# Altium schematic sheet 03_ICs.SchDoc: ICs (part 3 of 3)
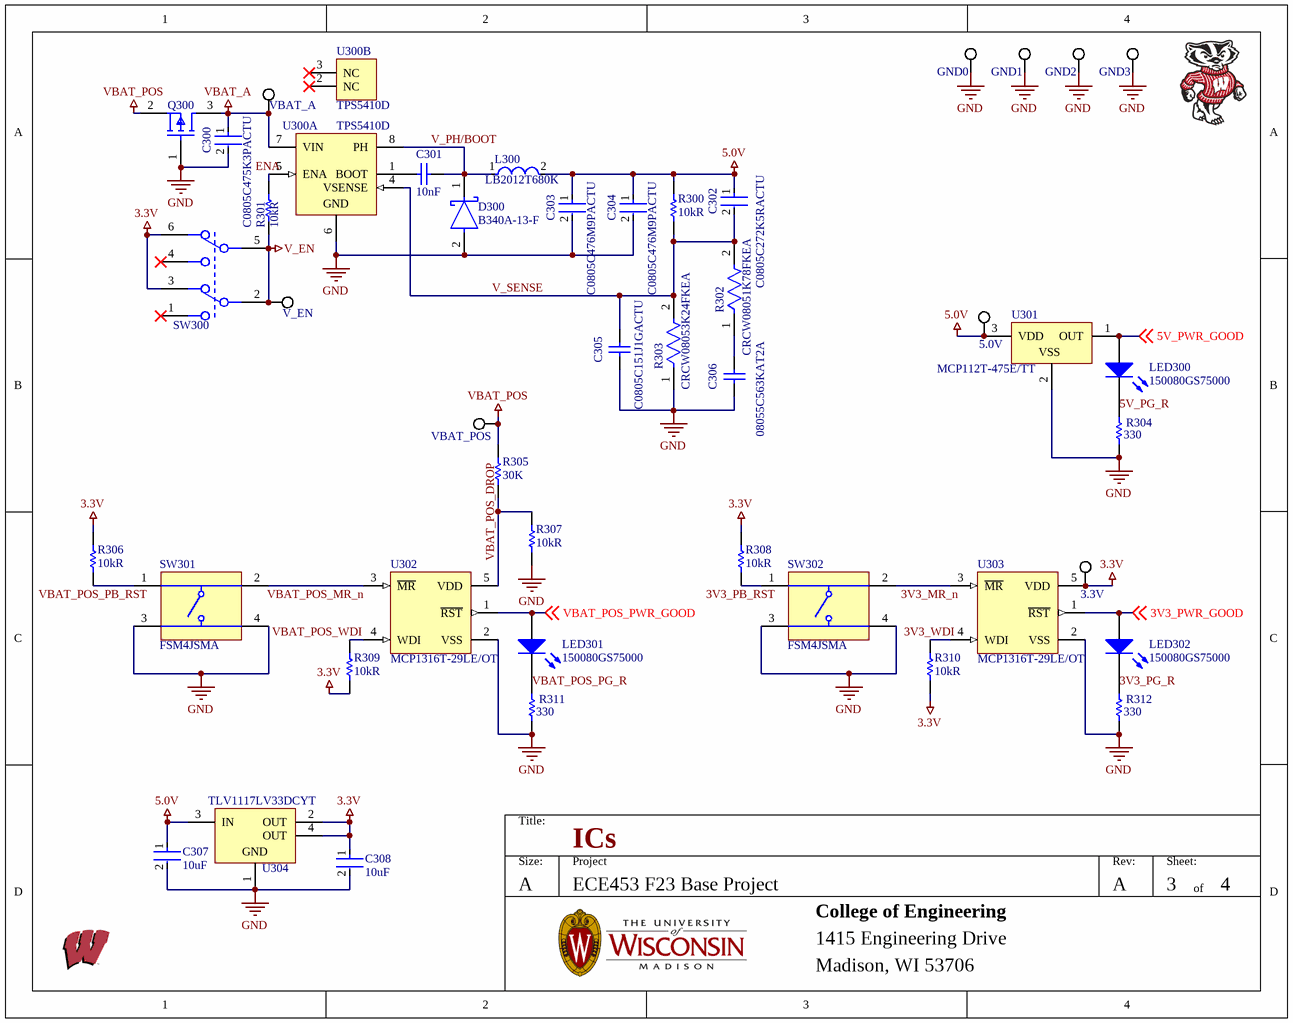
[diagram p2: 03_ICs.SchDoc]

## Library data of the parts (continued)
U300 = CMP-0323-00191-3: Buck Step Down Regulator with 5.5 to 36 V Input and 1.23 to 31 V Output, -40 to 125 degC, 8-Pin SOIC (D), Green (RoHS & no Sb/Br); Manufacturer: Texas Instruments; Switch Current Limit(Typ)(A): 1.2; Iq(Typ)(mA): 3; Rating: Catalog; Duty Cycle(Max)(%): 87.5; Iout(Max)(A): 1; Vin(Max)(V): 36; Vout(Min)(V): 1.23; Vout(Max)(V): 31; SubFamily: Step-Down Regulator; Vin(Min)(V): 5.5; Package Body Material: Plastic; Throw Configuration: SWITCHING REGULATOR; Control Technique: PULSE WIDTH MODULATION; Max Supply Voltage: 36V; Min Input Voltage: 5.5V; Max Output current: 1.8A; Frequency: 600kHz; Control Mode: VOLTAGE-MODE; Package Equivalence Code: SOP8,.25; Qualification Status: Not Qualified; ComponentLink2URL: http://www.ti.com/litv/pdf/msoi002j; PartNumber: TPS5410D; DatasheetVersion: SLVS675A; PackageDescription: 8-Pin Plastic Small Outline Integrated Circuit, 4.9 x 3.9 mm, Pitch 1.27 mm Pitch; Topology: Buck; PackageVersion: revM, Jun-2011; Code_JEDEC: MS-012AA; ComponentLink3Description: URL Link1; ComponentLink1Description: Datasheet; ComponentLink1URL: http://www.ti.com/general/docs/lit/getliterature.tsp?genericPartNumber=TPS5410&fileType=pdf; Eco-Plan: Green (RoHS & no Sb/Br); ComponentLink3URL: Samples URL:http://www.ti.com/product/tps5410#samples; Mounting Technology: Surface Mount; ComponentLink2Description: Package Specification; PackageReference: D0008A; Regulated Outputs(#): 1; Supplier: Digi-Key; Supplier Part Number: 296-20787-5-ND; Manufacturer Part Number: TPS5410D; RoHS: Yes; Category: Voltage Regulators - Switching; Stock: 6339; Pricing: 1=3.42, 10=3.072, 25=2.9044, 100=2.517, 250=2.38796, 500=2.1427, 1000=1.80709, 2500=1.71674, 5000=1.6522 (USD); Case/Package: SOP; Pins: 8; Package Shape: Rectangular; Terminal Finish: Nickel; Min Operating Temperature: -40°C; Max Operating Temperature: 125°C; JESD-609 Code: e4; Moisture Sensitivity Level: 2; Channels: 1; Package Style: SMALL OUTLINEMeter; Surface Mount: Yes; Switcher Configuration: BUCK; Terminal Form: Gull Wing; Terminal Position: DUAL; Peak Reflow Temperature (Cel): 260°C; JESD-30 Code: R-PDSO-G8; Length: 4.9mm; Width: 3.9mm; Height - Seated (Max): 1.75mm; Terminal Pitch: 1.27mm; Temperature Grade: AUTOMOTIVE; Reach SVHC Compliant: Yes; RoHS Compliant: Yes; ComponentLink4URL: https://www.ti.com:443/lit/ds/symlink/tps5410.pdf?src-supplier=IHS+Markit; ComponentLink4Description: https://www.ti.com:443/lit/ds/symlink/tps5410.pdf?src-supplier=IHS+Markit; ComponentLink5URL: https://datasheet.ciiva.com/15113/getdatasheetpartid-224296-15113874.pdf?src-supplier=Verical; ComponentLink5Description: https://datasheet.ciiva.com/15113/getdatasheetpartid-224296-15113874.pdf?src-supplier=Verical; ComponentLink6URL: https://datasheet.ciiva.com/2026/tps5410-2026736.pdf?src-supplier=Digi-Key; ComponentLink6Description: https://datasheet.ciiva.com/2026/tps5410-2026736.pdf?src-supplier=Digi-Key; ComponentLink7URL: https://datasheet.ciiva.com/27056/2003563-27056017.pdf?src-supplier=Jameco; ComponentLink7Description: https://datasheet.ciiva.com/27056/2003563-27056017.pdf?src-supplier=Jameco; ComponentLink8URL: https://datasheet.ciiva.com/7993/1851017-7993797.pdf?src-supplier=Element14; ComponentLink8Description: https://datasheet.ciiva.com/7993/1851017-7993797.pdf?src-supplier=Element14
U301 = CMP-0130-00073-1: 1.75Î¼A Micropower Voltage Detector, Push-Pull Output, 4.63V, 3-Pin SOT-23, Extended Temperature, Tape and Reel; Manufacturer: Microchip; Package Body Material: Plastic; Adjustable Threshold: No; Throw Configuration: POWER SUPPLY SUPPORT CIRCUIT; Number of Channels: 1; Package Equivalence Code: TO-236; Power Supplies: 1/5.5V; Supply Current-Max (Isup): 1.75uA; Max Supply Voltage: 5.5V; Min Supply Voltage: 1V; Time @ Peak Reflow Temperature-Max (s): 40s; Qualification Status: Not Qualified; PackageReference: SOT-23-TT3; DatasheetVersion: revD, Jun-2005; Code_IPC: SOT23-3; PackageDescription: 3-Lead Plastic Small Outline Transistor (TT) [SOT-23]; PackageVersion: revBB, Aug-2009; Supplier: Digi-Key; Supplier Part Number: MCP112T-475E/TTCT-ND; Manufacturer Part Number: MCP112T-475E/TT; RoHS: Yes; Category: Voltage Supervisors; Stock: 2856; Pricing: 1=0.6, 25=0.5, 100=0.46 (USD); Case/Package: TSSOP; Pins: 3; Package Shape: Rectangular; Terminal Finish: Tin; Min Operating Temperature: -40°C; Max Operating Temperature: 125°C; JESD-609 Code: e3; JESD-30 Code: R-PDSO-G3; Moisture Sensitivity Level: 1; Channels: 1; Package Style: SMALL OUTLINE, THIN PROFILE, SHRINK PITCHMeter; Peak Reflow Temperature (Cel): 260°C; Surface Mount: Yes; Terminal Form: Gull Wing; Terminal Position: DUAL; Threshold Voltage-Nom: 4.63V; Length: 2.92mm; Width: 1.3mm; Height - Seated (Max): 1.12mm; Terminal Pitch: 0.96mm; Temperature Grade: AUTOMOTIVE; Reach SVHC Compliant: Yes; RoHS Compliant: Yes; ComponentLink1URL: https://datasheet.ciiva.com:443/pdfs/VipMasterIC/IC/MCHP/MCHP-S-A0002312823/MCHP-S-A0002312823-1.pdf?src-supplier=IHS+Markit; ComponentLink1Description: https://datasheet.ciiva.com:443/pdfs/VipMasterIC/IC/MCHP/MCHP-S-A0002312823/MCHP-S-A0002312823-1.pdf?src-supplier=IHS+Markit; ComponentLink2URL: https://datasheet.ciiva.com/1974/21889d-1974510.pdf?src-supplier=Digi-Key; ComponentLink2Description: https://datasheet.ciiva.com/1974/21889d-1974510.pdf?src-supplier=Digi-Key; ComponentLink3URL: https://datasheet.ciiva.com/1974/21889d-1974511.pdf?src-supplier=Digi-Key; ComponentLink3Description: https://datasheet.ciiva.com/1974/21889d-1974511.pdf?src-supplier=Digi-Key; ComponentLink4URL: https://datasheet.ciiva.com/1974/21889d-1974512.pdf?src-supplier=Digi-Key; ComponentLink4Description: https://datasheet.ciiva.com/1974/21889d-1974512.pdf?src-supplier=Digi-Key; ComponentLink5URL: https://datasheet.ciiva.com/9215/21889d-9215465.pdf?src-supplier=Avnet; ComponentLink5Description: https://datasheet.ciiva.com/9215/21889d-9215465.pdf?src-supplier=Avnet; ComponentLink6URL: https://datasheet.ciiva.com/1170/21889d-1170331.pdf?src-supplier=Element14; ComponentLink6Description: https://datasheet.ciiva.com/1170/21889d-1170331.pdf?src-supplier=Element14
U302 U303 = CMP-0138-00207-1: Voltage Supervisor, 5-Pin SOT-23, Extended Temperature, Tape and Reel; Manufacturer: Microchip; Min Supply Voltage: 1V; Max Supply Voltage: 5.5V; Number of Voltages Monitored: 1; Overvoltage Threshold: 2.944V; Undervoltage Threshold: 2.857V; Operating Supply Current: 10uA; Reset: Active Low; Reset Timeout: 140ms; Threshold Voltage: 2.9V; Watchdog Timer: Yes; Quiescent Current: 1uA; Max Output current: 10mA; Max Power Dissipation: 240mW; Output: TOTEM-POLE; PackageReference: SOT-23-OT5; Code_IPC: SOT23-5; DatasheetVersion: revB, Oct-2007; PackageDescription: 5-Lead Plastic Small Outline Transistor (OT) [SOT-23]; PackageVersion: revBB, Aug-2009; Supplier: Newark; Supplier Part Number: 34M7402; Manufacturer Part Number: MCP1316T-29LE/OT; RoHS: Yes; Category: Voltage Supervisors; Stock: 8598; Pricing: 1=0.877, 10=0.805, 25=0.732 (USD); Mounting Technology: Surface Mount; Case/Package: SOT-23; Pins: 5; Min Operating Temperature: -40°C; Max Operating Temperature: 125°C; Packaging: Tape and Reel; Type: Simple Reset/Power-On Reset; Package Quantity: 3000; Max Supply Current: 10uA; Max Reset Threshold Voltage: 2.944V; Min Reset Threshold Voltage: 2.857V; Supply Current: 10uA; Number of Elements: 1; Power Dissipation: 240mW; Termination: SMD/SMT; Length: 3.1mm; Width: 1.8mm; Height: 1.3mm; Radiation Hardening: No; Reach SVHC Compliant: No; Lead Free: Lead Free; RoHS Compliant: Yes; ComponentLink1URL: https://datasheet.ciiva.com/1969/21985d-1969832.pdf?src-supplier=Digi-Key; ComponentLink1Description: https://datasheet.ciiva.com/1969/21985d-1969832.pdf?src-supplier=Digi-Key; ComponentLink2URL: https://datasheet.ciiva.com/1969/21985d-1969833.pdf?src-supplier=Digi-Key; ComponentLink2Description: https://datasheet.ciiva.com/1969/21985d-1969833.pdf?src-supplier=Digi-Key; ComponentLink3URL: https://datasheet.ciiva.com/14562/70045388-14562791.pdf?src-supplier=Allied+Electronics; ComponentLink3Description: https://datasheet.ciiva.com/14562/70045388-14562791.pdf?src-supplier=Allied+Electronics; ComponentLink4URL: https://datasheet.ciiva.com/8140/21985c-8140440.pdf?src-supplier=Avnet; ComponentLink4Description: https://datasheet.ciiva.com/8140/21985c-8140440.pdf?src-supplier=Avnet
U304 = CMP-0395-00499-2: Single Output LDO, 1 A, Fixed 3.3 V Output, 2 to 5.5 V Input, 4-pin SOT-223 (DCY), -40 to 125 degC, Green (RoHS & no Sb/Br); Manufacturer: Texas Instruments; Manufacturer Part Number: TLV1117-33CDCYR; Vout Adj(Max)(V): 3.3; Iout(Max)(A): 1; SubFamily: Single Channel LDO; Iq(Typ)(mA): 0.05; Accuracy(%): 2; Vin(Max)(V): 5.5; Vdo(Typ)(mV): 1200; Max Power Dissipation: 1.59W; Dropout Voltage: 455mV; Output Voltage: 3.3V; Output Current: 1A; Max Input Voltage: 5.5V; Min Input Voltage: 2V; Min Current Limit: 1.1A; Polarity: Positive; Quiescent Current: 50uA; Output Voltage Accuracy: 1.5%; Accuracy: 2%; Power Supply Rejection Ratio (PSRR): 75dB; Max Supply Voltage: 15V; PartNumber: TLV1117LV33DCYT; PackageReference: DCY0004A; PackageVersion: 4202506/B; ComponentLink1URL: http://www.ti.com/; DatasheetVersion: SBVS160A; Mounting Technology: Surface Mount; Fixed Output Options(V): 3.3; ComponentLink3Description: Package Specification; PackageDescription: 4-Pin Plastic Small Outline, Body 3.5 x 6.5 mm, Pitch 2.3 mm; Vout Adj(Min)(V): 3.3; ComponentLink2URL: http://www.ti.com/general/docs/lit/getliterature.tsp?genericPartNumber=TLV1117LV33&fileType=pdf; Code_JEDEC: TO-261; ComponentLink1Description: Manufacturer URL; Vin(Min)(V): 2; ComponentLink2Description: Datasheet; Eco-Plan: Green (RoHS & no Sb/Br); ComponentLink3URL: http://www.ti.com/litv/pdf/mpds094a; Supplier 1: Digi-Key; Supplier Part Number 1: 296-35976-1-ND; Manufacturer 1: Texas Instruments; Manufacturer Part Number 1: TLV1117LV33DCYT; RoHS: Yes; Category: Voltage Regulators - Linear; Stock 1: 1411; Pricing 1: 1=1.15000, 10=1.02600, 25=0.97360, 100=0.79970 (USD); Case/Package: SOT-223; Number of Pins: 4; Contact Plating: Tin; Min Operating Temperature: -40°C; Max Operating Temperature: 125°C; Package Quantity: 250; Packaging: Tape and Reel; Number of Outputs: 1; Nominal Output Voltage: 3.3V; Max Output Current: 1A; Number of Regulators: 1; Power Dissipation: 1.59W; Max Output Voltage: 3.3V; Min Output Voltage: 3.3V; Output Type: Fixed; Series: -; Output Configuration: Positive; Radiation Hardening: No; Reach SVHC Compliant: Yes; Lead Free: Lead Free; RoHS Compliant: Yes; ComponentLink4URL: http://www.ti.com/general/docs/lit/getliterature.tsp?genericPartNumber=TLV1117LV&&fileType=pdf&src-supplier=Farnell; ComponentLink4Description: http://www.ti.com/general/docs/lit/getliterature.tsp?genericPartNumber=TLV1117LV&&fileType=pdf&src-supplier=Farnell; ComponentLink5URL: http://www.farnell.com/datasheets/1950591.pdf?src-supplier=Element14; ComponentLink5Description: http://www.farnell.com/datasheets/1950591.pdf?src-supplier=Element14; ComponentLink6URL: http://www.ti.com/lit/ds/symlink/tlv1117lv.pdf?src-supplier=Digi-Key; ComponentLink6Description: http://www.ti.com/lit/ds/symlink/tlv1117lv.pdf?src-supplier=Digi-Key; ComponentLink7URL: http://www.ti.com/general/docs/suppproductinfo.tsp?distId=10&amp;gotoUrl=http%3A%2F%2Fwww.ti.com%2Flit%2Fgpn%2Ftlv1117lv&src-supplier=Digi-Key; ComponentLink7Description: http://www.ti.com/general/docs/suppproductinfo.tsp?distId=10&amp;gotoUrl=http%3A%2F%2Fwww.ti.com%2Flit%2Fgpn%2Ftlv1117lv&src-supplier=Digi-Key; ComponentLink8URL: http://www.ti.com/lit/gpn/tlv1117lv?src-supplier=Mouser; ComponentLink8Description: http://www.ti.com/lit/gpn/tlv1117lv?src-supplier=Mouser; ComponentLink9URL: http://www.ti.com/general/docs/lit/getliterature.tsp?genericPartNumber=TLV1117LV&&fileType=pdf&src-supplier=Avnet; ComponentLink9Description: http://www.ti.com/general/docs/lit/getliterature.tsp?genericPartNumber=TLV1117LV&&fileType=pdf&src-supplier=Avnet; ComponentLink10URL: http://components.arrow.com/part/dataview/51117919S8954709N7713?src-supplier=Arrow+Electronics; ComponentLink10Description: http://components.arrow.com/part/dataview/51117919S8954709N7713?src-supplier=Arrow+Electronics; Supplier: Newark; Supplier Part Number: 29AH1523; Pricing: 1=0.965, 10=0.923, 25=0.877, 50=0.839, 100=0.803, 250=0.777, 500=0.759, 1000=0.746 (USD); Pins: 3; ComponentLink11URL: http://www.ti.com/general/docs/lit/getliterature.tsp?genericPartNumber=TLV1117-33&amp;&amp;fileType=pdf&src-supplier=Newark; ComponentLink11Description: http://www.ti.com/general/docs/lit/getliterature.tsp?genericPartNumber=TLV1117-33&amp;&amp;fileType=pdf&src-supplier=Newark; ComponentLink12URL: http://www.ti.com/general/docs/suppproductinfo.tsp?distId=10&amp;gotoUrl=http%3A%2F%2Fwww.ti.com%2Flit%2Fgpn%2Ftlv1117&src-supplier=Digi-Key; ComponentLink12Description: http://www.ti.com/general/docs/suppproductinfo.tsp?distId=10&amp;gotoUrl=http%3A%2F%2Fwww.ti.com%2Flit%2Fgpn%2Ftlv1117&src-supplier=Digi-Key